# Altium project PA.PrjPcb
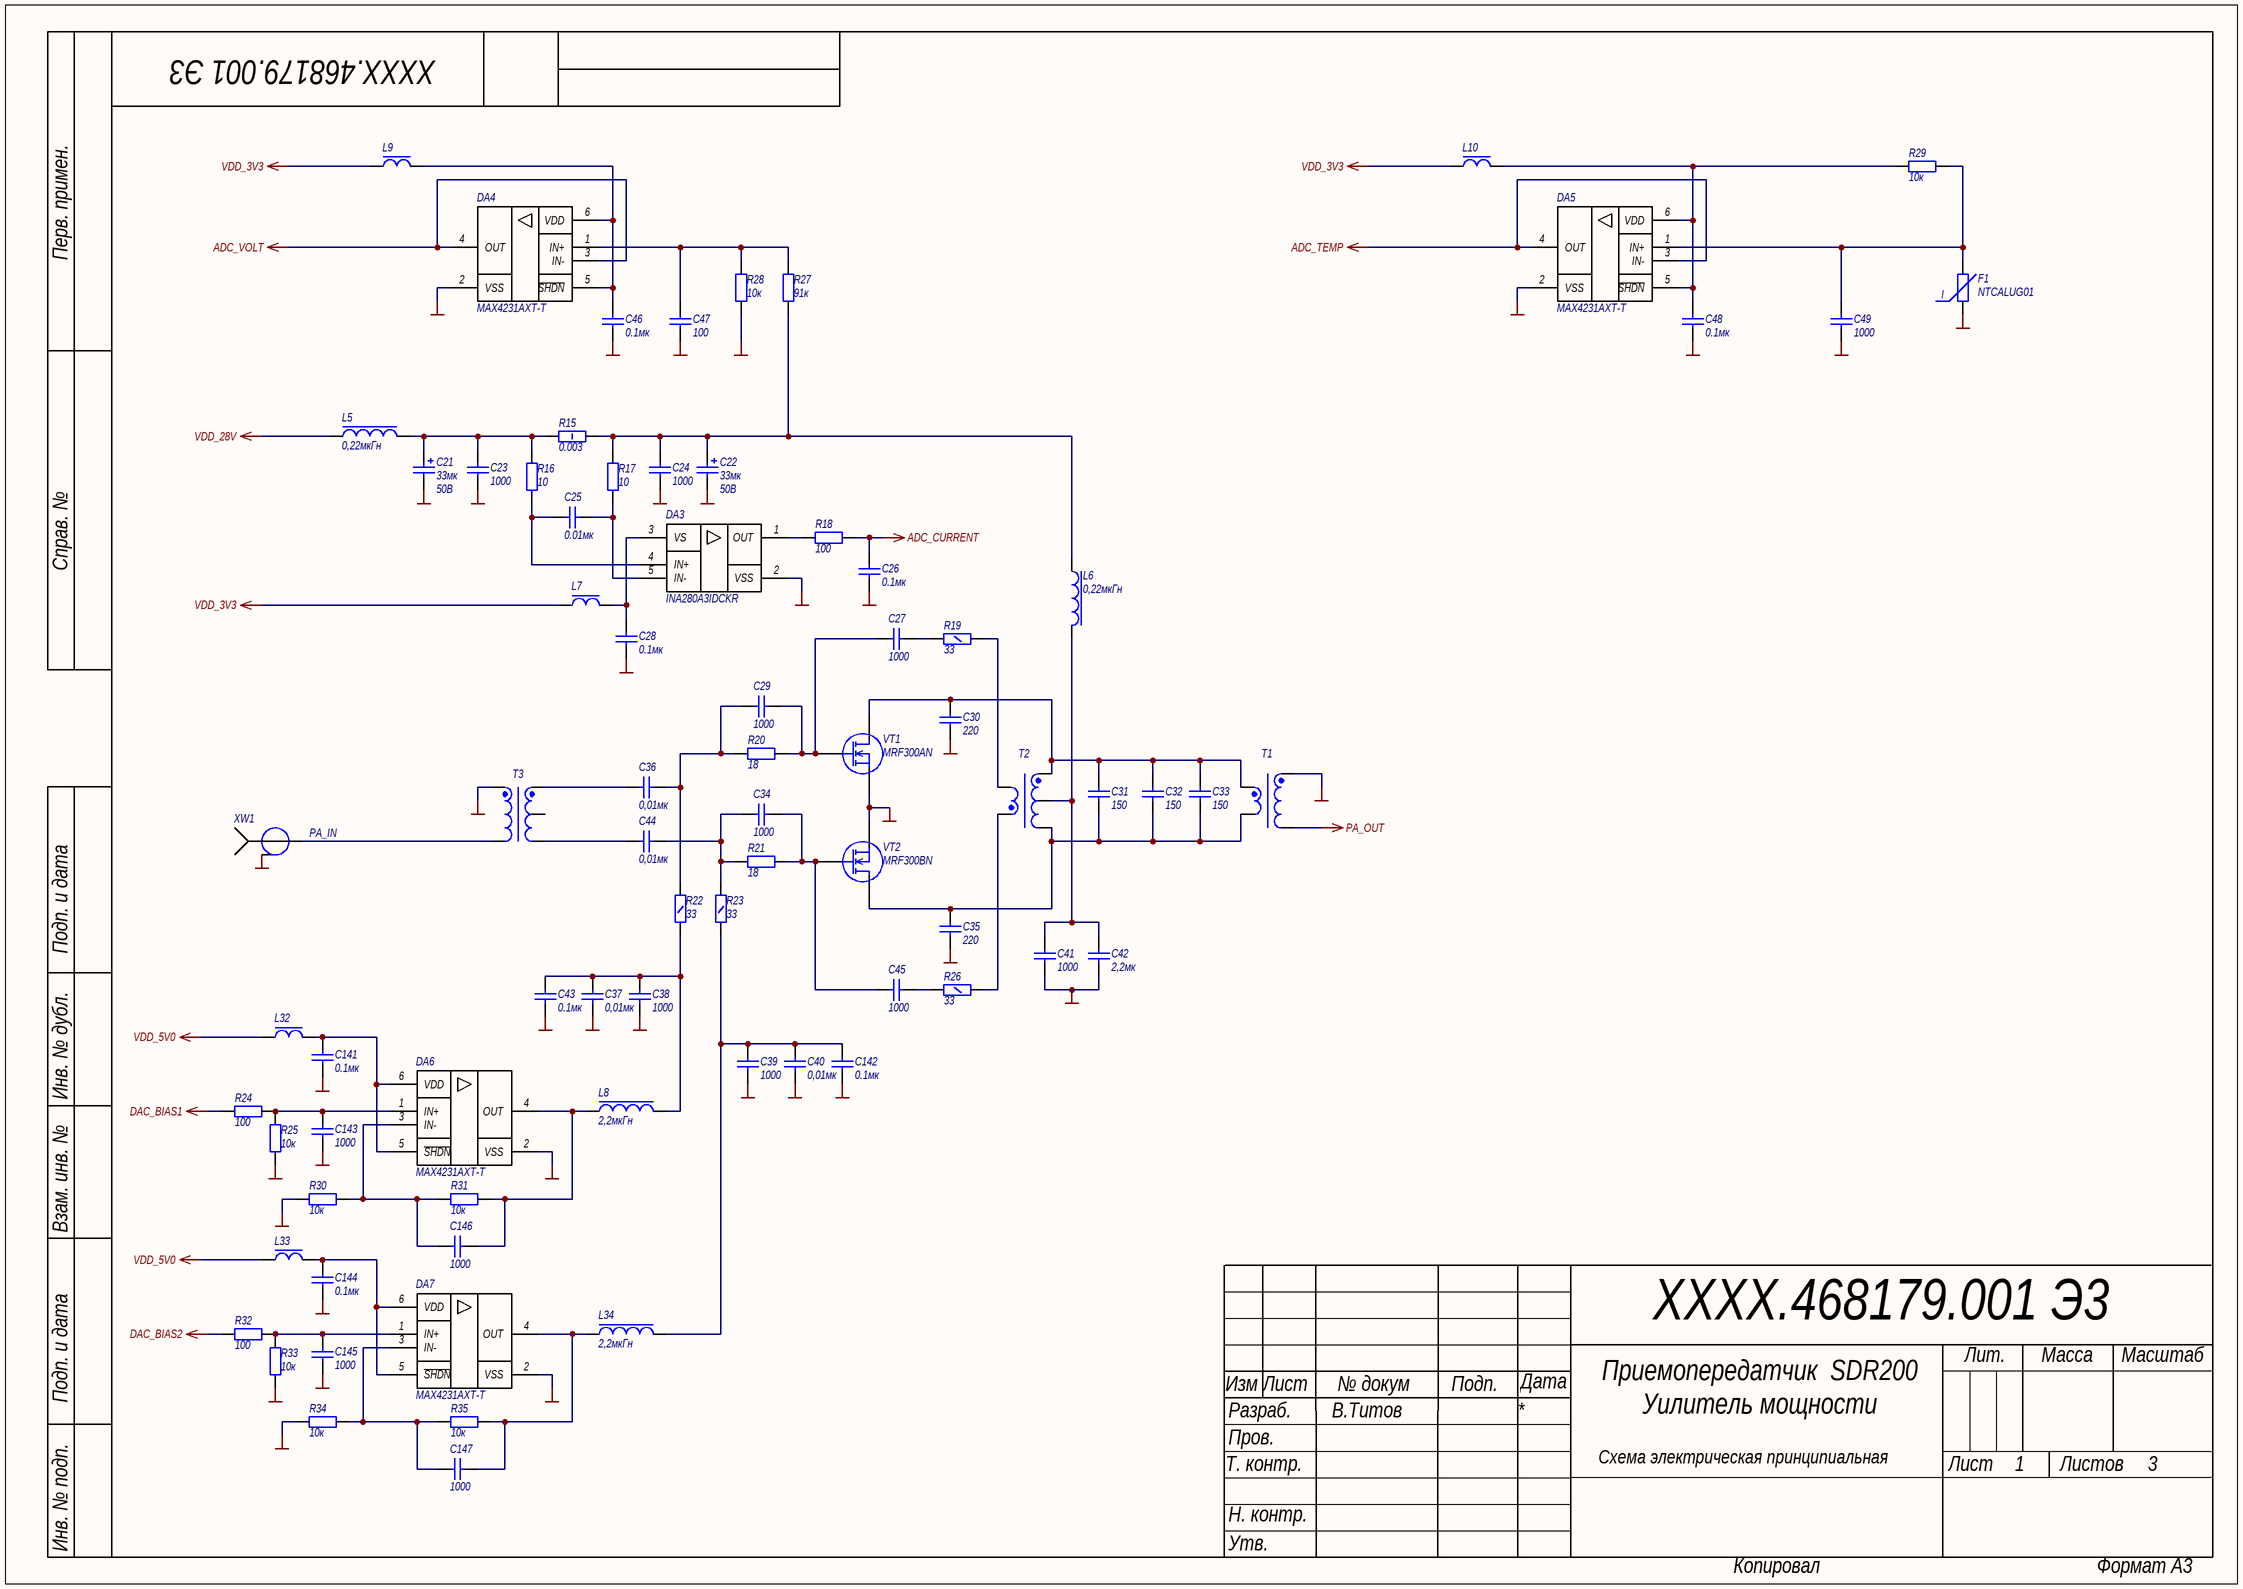
[diagram p0: PA_AMP_v1.SchDoc]
3 sheets, 288 parts. Net scope: global (net labels, ports and power ports of the same name join across sheets).
Board file: PA_v1.PcbDoc
Sheets:
  PA_AMP_v1.SchDoc
  PA_LPF.SchDoc
  PA_MCU.SchDoc

## Sheet PA_AMP_v1.SchDoc: Приемопередатчик  SDR200
size 420 x 297 mm; Author: В.Титов; DrawnBy: В.Титов; DocumentNumber: ХХХХ.468179.001 Э3; SheetNumber: 1; SheetTotal: 3; DocumentType: Схема электрическая принципиальная; Title2: Уилитель мощности; Scale: 1:1

### Parts
C21  Power/Voltage: 50В  [CAPAE7664X77L]  (hidden comment: 33мк)
C22  Power/Voltage: 50В  [CAPAE7664X77L]  (hidden comment: 33мк)
C23  1000  [CAPC2012X12L]
C24  1000  [CAPC2012X12L]
C25  0.01мк  [CAPC1005X06N]
C26  0.1мк  [CAPC1005X06N]
C27  1000  [CAPC3216X19L]
C28  0.1мк  [CAPC1005X06N]
C29  1000  [CAPC2012X12L]
C30  220  [CAPC3216X19L]
C31  150  [CAPC3216X19L]
C32  150  [CAPC3216X19L]
C33  150  [CAPC3216X19L]
C34  1000  [CAPC2012X12L]
C35  220  [CAPC3216X19L]
C36  0,01мк  [CAPC2012X12L]
C37  0,01мк  [CAPC2012X12L]
C38  1000  [CAPC2012X12L]
C39  1000  [CAPC2012X12L]
C40  0,01мк  [CAPC2012X12L]
C41  1000  [CAPC3216X19L]
C42  2,2мк  [CAPC3216X19L]
C43  0.1мк  [CAPC1608X08L]
C44  0,01мк  [CAPC2012X12L]
C45  1000  [CAPC3216X19L]
C46  0.1мк  [CAPC1005X06N]
C47  100  [CAPC1005X06N]
C48  0.1мк  [CAPC1005X06N]
C49  1000  [CAPC1005X06N]
C141  0.1мк  [CAPC1005X06N]
C142  0.1мк  [CAPC1608X08L]
C143  1000  [CAPC1005X06N]
C144  0.1мк  [CAPC1005X06N]
C145  1000  [CAPC1005X06N]
C146  1000  [CAPC1005X06N]
C147  1000  [CAPC1005X06N]
DA3  INA280A3IDCKR  [SOT65P210X110-5L]
DA4  MAX4231AXT-T  [TSOP65P210X100-6L]
DA5  MAX4231AXT-T  [TSOP65P210X100-6L]
DA6  MAX4231AXT-T  [TSOP65P210X100-6L]
DA7  MAX4231AXT-T  [TSOP65P210X100-6L]
F1  NTCALUG01  [NTCALUG01T]
L5  0,22мкГн  [CSAB0530]
L6  0,22мкГн  [CSAB0530]
L7  BLM18PG121SN1D  [INDC1608X08L]  (value not drawn)
L8  2,2мкГн  [CSAB0420]
L9  BLM18PG121SN1D  [INDC1608X08L]  (value not drawn)
L10  BLM18PG121SN1D  [INDC1608X08L]  (value not drawn)
L32  BLM18PG121SN1D  [INDC1608X08L]  (value not drawn)
L33  BLM18PG121SN1D  [INDC1608X08L]  (value not drawn)
L34  2,2мкГн  [CSAB0420]
R15  0.003  [RESC6332X04N]
R16  10  [RESC1005X06N]
R17  10  [RESC1005X06N]
R18  100  [RESC1005X06N]
R19  33  [RESC3216X04L]
R20  18  [RESC2012X05L]
R21  18  [RESC2012X05L]
R22  33  [RESC3216X04L]
R23  33  [RESC3216X04L]
R24  100  [RESC1005X06N]
R25  10к  [RESC1005X06N]
R26  33  [RESC3216X04L]
R27  91к  [RESC1005X06N]
R28  10к  [RESC1005X06N]
R29  10к  [RESC1005X06N]
R30  10к  [RESC1005X06N]
R31  10к  [RESC1005X06N]
R32  100  [RESC1005X06N]
R33  10к  [RESC1005X06N]
R34  10к  [RESC1005X06N]
R35  10к  [RESC1005X06N]
T1  Трансформатор PUM_IN  [TRSF_OUT]  (value not drawn)
T2  Трансформатор PUM_IN  [TRSF_VOLT]  (value not drawn)
T3  Трансформатор PUM_IN  [Transformer_KV_PAIN]  (value not drawn)
VT1  MRF300AN  [TO-247-3]
VT2  MRF300BN  [TO-247-3]
XW1  SMA-JR  [SMA-JR]  (value not drawn)

### Nets
ADC_CURRENT: C26.2 R18.1
ADC_TEMP: DA5.3(IN-) DA5.4(OUT)
ADC_VOLT: DA4.3(IN-) DA4.4(OUT)
DAC_BIAS1: R24.1
DAC_BIAS2: R32.1
GND: C21.2 C22.2 C23.1 C24.1 C26.1 C28.1 C30.1 C35.1 C37.1 C38.1 C39.1 C40.1 C41.1 C42.1 C43.1 C46.2 C47.2 C48.2 C49.2 C141.1 C142.1 C143.1 C144.1 C145.1 DA3.2(VSS) DA4.2(VSS) DA5.2(VSS) DA6.2(VSS) DA7.2(VSS) F1.2 R25.2 R28.1 R30.1 R33.2 R34.1 T1.3 T3.5(PRIMARY_DOT) VT1.2(S) VT2.2(S) XW1.2
PA_OUT: T1.4
VDD_3V3: L7.1 L9.1 L10.1
VDD_5V0: L32.1 L33.1
VDD_28V: L5.1
NetC21_1: C21.1 C23.2 L5.2 R15.1 R16.1
NetC22_1: C22.1 C24.2 L6.1 R15.2 R17.1 R27.2
NetC25_1: C25.1 DA3.5(GND) R17.2
NetC25_2: C25.2 DA3.4(IN+) R16.2
NetC27_1: C27.1 R19.1
NetC27_2: C27.2 C29.1 R20.2 VT1.1(GATE)
NetC28_2: C28.2 DA3.3(VS) L7.2
NetC29_2: C29.2 C36.1 R20.1 R22.1
NetC30_2: C30.2 C31.2 C32.2 C33.2 T1.1 T2.1 VT1.3(D)
NetC31_1: C31.1 C32.1 C33.1 C35.2 T1.2 T2.3 VT2.1(D)
NetC34_1: C34.1 C45.2 R21.2 VT2.3(GATE)
NetC34_2: C34.2 C44.1 R21.1 R23.1
NetC36_2: C36.2 T3.1(SECONDARY_DOT)
NetC37_2: C37.2 C38.2 C43.2 L8.2 R22.2
NetC39_2: C39.2 C40.2 C142.2 L34.2 R23.2
NetC41_2: C41.2 C42.2 L6.2 T2.2
NetC44_2: C44.2 T3.3(SECONDARY)
NetC45_1: C45.1 R26.1
NetC46_1: C46.1 DA4.5(GND) DA4.6(VDD) L9.2
NetC47_1: C47.1 DA4.1(IN+) R27.1 R28.2
NetC48_1: C48.1 DA5.5(GND) DA5.6(VDD) L10.2 R29.1
NetC49_1: C49.1 DA5.1(IN+) F1.1 R29.2
NetC141_2: C141.2 DA6.5(GND) DA6.6(VDD) L32.2
NetC143_2: C143.2 DA6.1(IN+) R24.2 R25.1
NetC144_2: C144.2 DA7.5(GND) DA7.6(VDD) L33.2
NetC145_2: C145.2 DA7.1(IN+) R32.2 R33.1
NetC146_1: C146.1 DA6.4(OUT) L8.1 R31.2
NetC146_2: C146.2 DA6.3(IN-) R30.2 R31.1
NetC147_1: C147.1 DA7.4(OUT) L34.1 R35.2
NetC147_2: C147.2 DA7.3(IN-) R34.2 R35.1
NetDA3_1: DA3.1(OUT) R18.2
NetR19_2: R19.2 T2.4(FB)
NetR26_2: R26.2 T2.5(FB)
NetT3_4: T3.4(PRIMARY) XW1.1

Not connected (* = marked no-connect by the designer): T3 2(SECONARY_CT)

### Notes on the sheet
- (near XW1) PA_IN
- Перв. примен.
- Справ. №
- Подп. и дата
- Инв. № дубл.
- Взам. инв. №
- Изм
- Лист
- № докум
- Подп.
- Дата
- Лит.
- Масса
- Масштаб
- Т. контр.
- Разраб.
- Пров.
- Листов
- Н. контр.
- Инв. № подп.
- Утв.
- Копировал
- Формат А3
- (in symbol Терморезистор NTCALUG01) I

### Library data of the parts
C21 C22 = Конденсатор гибридный SMD 33мкФ ±20% 50В: Гибридный ЧИП-конденсатор; ManufacturerPartNumber: EEHZC1H330XP; Manufacturer: Panasonic; Tolerance: ±20%; Published: 8-Jun-2000; LatestRevisionDate: 29-May-2009; LatestRevisionNote: IPC-7351 Footprint Added.; Publisher: Altium Limited; PackageDescription: ZC Series - Anti-Vibration; PackageReference: ZC Series; Value: 33мк
C23 C24 C29 C34 C38 C39 = Кер.ЧИП конд. 0805 1000пФ X7R 10% 100В: Кер. ЧИП-конденсатор; Manufacturer: WALSIN; ManufacturerPartNumber: 0805B102K100; Power/Voltage: 100В; TKE: X7R; Tolerance: ±10%; Value: 1000
C25 = Кер.ЧИП конд. 0402 0.01мкФ X7R 10%, 50В: Кер. ЧИП-конденсатор; Power/Voltage: 50В; TKE: X7R; Tolerance: ±20%; Value: 0.01мк
C26 C28 C46 C48 C141 C144 = Кер.ЧИП конд. 0402 0.1мкФ X7R 10%, 16В: Кер. ЧИП-конденсатор; Power/Voltage: 16В; TKE: X7R; Tolerance: ±10%; PackageReference: 0402; Value: 0.1мк
C27 C41 C45 = Кер.ЧИП конд. 1206 1000пФ X7К 10% 2000В: Кер. ЧИП-конденсатор; Manufacturer: Johanson; ManufacturerPartNumber: 202R18W102KV4E; Power/Voltage: 2000В; TKE: X7R; Tolerance: ±10%; Value: 1000
C30 C35 = Кер.ЧИП конд. 1206 220пФ NP0 5% 2000В: Кер. ЧИП-конденсатор; Manufacturer: Johanson; ManufacturerPartNumber: 202R18W102KV4E; Power/Voltage: 2000В; TKE: X7R; Tolerance: ±10%; Value: 220
C31-C33 = Кер.ЧИП конд. 1206 150пФ NP0 5% 2000В: Кер. ЧИП-конденсатор; Manufacturer: Johanson; ManufacturerPartNumber: 202R18W102KV4E; Power/Voltage: 2000В; TKE: X7R; Tolerance: ±10%; Value: 150
C36 C37 C40 C44 = Кер.ЧИП конд. 0805 0,01 мкФ X7R 10% 250В: Кер. ЧИП-конденсатор; Manufacturer: Murate; ManufacturerPartNumber: GRM21BR72E103KW03; Power/Voltage: 250В; TKE: X7R; Tolerance: ±10%; Value: 0,01мк
C42 = Кер.ЧИП конд. 1206 2,2мкФ X7R 10% 100В: Кер. ЧИП-конденсатор; Manufacturer: Murata; ManufacturerPartNumber: GRM31CR72A225KA73L; Power/Voltage: 100В; TKE: X7R; Tolerance: ±10%; Value: 2,2мк
C43 C142 = Кер.ЧИП конд. 0603 0.1мкФ X7R 10% 50В: Кер. ЧИП-конденсатор; Manufacturer: Murata; ManufacturerPartNumber: GRM188R71H104KA93D; Power/Voltage: 50В; TKE: X7R; Tolerance: ±10%; Value: 0.1мк
C47 = Кер.ЧИП конд. 0402 100пФ NPO 5%, 50В: Кер. ЧИП-конденсатор; Power/Voltage: 50В; TKE: NPO; Tolerance: ±5%; PackageReference: 0402; Value: 100
C49 C143 C145-C147 = Кер.ЧИП конд. 0402 1000пФ NP0 5%, 50В: Кер. ЧИП-конденсатор; Power/Voltage: 50В; TKE: NPO; Tolerance: ±5%; PackageReference: 0402; Value: 1000
DA3 = Микросхема INA280A3IDCKR: 2.7-V to 120-V, 1.1-MHz, High Precision Current Sense Amplifier in Small / (SC-70) Package; Manufacturer: TI; Value: INA280A3IDCKR; ComponentLink1Description: datasheet; ComponentLink1URL: https://datasheets.maximintegrated.com/en/ds/MAX4230-MAX4234.pdf
DA4-DA7 = Микросхема MAX4231AXT-T: High-Output-Drive, 10MHz, 10V/μs,  Rail-to-Rail I/O Op Amps with Shutdown in SC70; Manufacturer: MAXIM; Value: MAX4231AXT-T; ComponentLink1Description: datasheet; ComponentLink1URL: https://datasheets.maximintegrated.com/en/ds/MAX4230-MAX4234.pdf
F1 = Терморезистор NTCALUG01: ЧИП-резистор; Value: NTCALUG01
L5 L6 = ЧИП индуктивность CDCSAB0530-R22M: 0.22мкГн, 19А, 5.2х5.0х3мм, Катушка индуктивности SMD; Manufacturer: Vishay; ManufacturerPartNumber: CDCSAB0530-R22M; Value: 0,22мкГн
L7 L9 L10 L32 L33 = ЧИП дроссель 0603 BLM18PG121SN1D: SMD EMI Suppression Filter EMIFIL; Manufacturer: Murata; ManufacturerPartNumber: BLM18PG121SN1D; Value: BLM18PG121SN1D
L8 L34 = ЧИП индуктивность CSAB0420-2R2M: Molding Power Choke; Manufacturer: Vishay; ManufacturerPartNumber: IHLP1616ABER1R0M11; Value: 2,2мкГн
R15 = Чип резистор 2512 0.003Ом, 5%: ЧИП-резистор PA2512FKF070R003E; Tolerance: ±5%; Value: 0.003
R16 R17 = Чип резистор 0402 10 Ом, 5%: ЧИП-резистор; Tolerance: ±5%; TKE: 100 ppm/°С; PackageReference: 0402; Value: 10
R18 R24 R32 = Чип резистор 0402 100 Ом, 5%: ЧИП-резистор; Tolerance: ±5%; TKE: 100 ppm/°С; PackageReference: 0402; Value: 100
R19 R22 R23 R26 = Чип резистор 1206 33 Ом, 5%: ЧИП-резистор; Manufacturer: ROHM; Tolerance: ±5%; TKE: 300 ppm/°С; PackageReference: 1206; Value: 33
R20 R21 = Чип резистор 0805 18 Ом, 5%: ЧИП-резистор; Tolerance: ±5%; TKE: 100 ppm/°С; PackageReference: 0805; Value: 18
R25 R28-R31 R33-R35 = Чип резистор 0402 10 кОм, 5%: ЧИП-резистор; Tolerance: ±5%; TKE: 100 ppm/°С; PackageReference: 0402; Value: 10к
R27 = Чип резистор 0402 91 кОм, 5%: ЧИП-резистор; Tolerance: ±5%; TKE: 100 ppm/°С; PackageReference: 0402; Value: 91к
T1 = Трансформатор PA_OUT
T2 = Трансформатор PA_OUT_VOLT
T3 = Transformer_KV_PA: Трансформатор на бинокле BN-43-302 (2843000302)mu850 / Первичная обмотка - 2 витка проводом МГТФ 0,12 / Вторичная обмотка - 2 витка проводом МГТФ 0,12; Manufacturer: НЕЛС; Manufacturer Part Number: Трансформатор PUM_IN АНЕЛ.671143.002; SubType: Трансформатор бинокле; Package: BN-43-302 (2843000302) 13.3x10.3 mm; Type: Трансформатор
VT1 = Транзистор MRF300AN: RF Power LDMOS Transistors; ComponentLink1Description: datasheet; ComponentLink1URL: https://www.nxp.com/docs/en/data-sheet/MRF300AN.pdf; Value: MRF300AN
VT2 = Транзистор MRF300BN: RF Power LDMOS Transistors; ComponentLink1Description: datasheet; ComponentLink1URL: https://www.nxp.com/docs/en/data-sheet/MRF300AN.pdf; Value: MRF300BN
XW1 = Соединитель коаксиальный SMA-JR: SMA-JR Разъем SMA гнездо на плату, прямой угол; Value: SMA-JR; ComponentLink1Description: datasheet; ComponentLink1URL: http://www.brownbear.ru/goods/2243.html

## Sheet PA_LPF.SchDoc: Приемопередатчик  SDR200
size 420 x 297 mm; Author: В.Титов; DrawnBy: В.Титов; DocumentNumber: ХХХХ.468179.001 Э3; SheetNumber: 2; SheetTotal: 3; DocumentType: Схема электрическая принципиальная; Title2: Усилитель мощности; Scale: 1:1
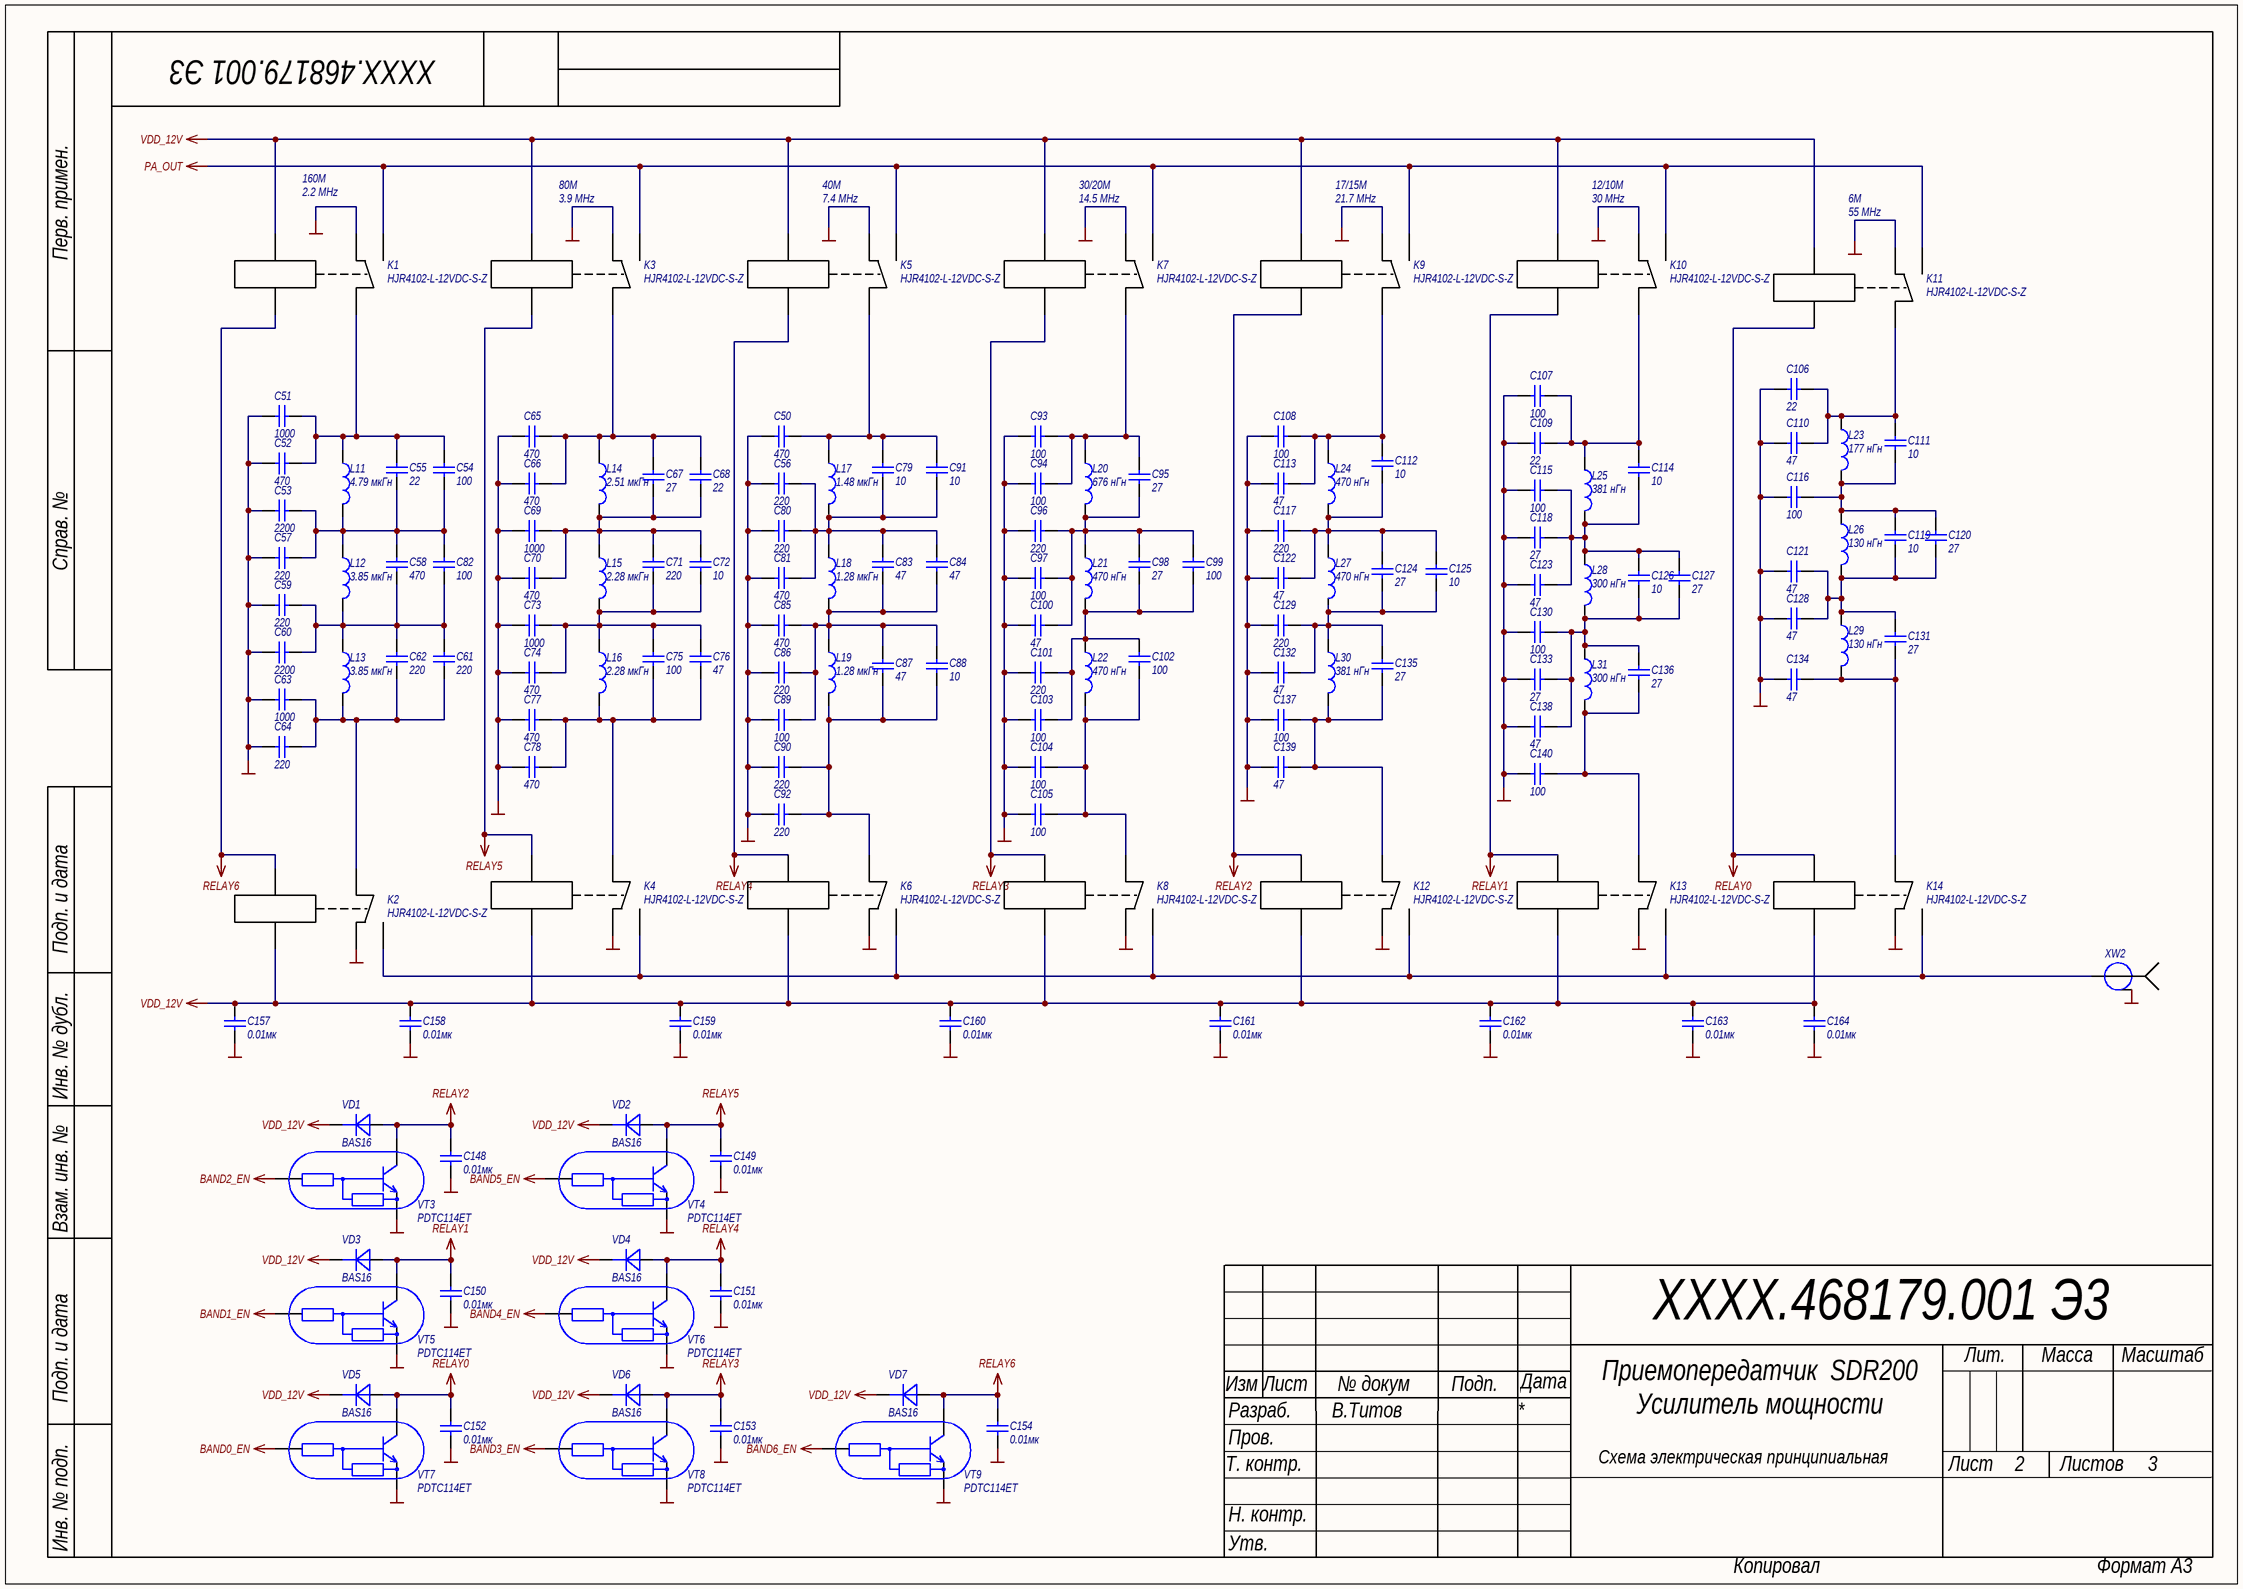
[diagram p1: PA_LPF.SchDoc]

### Parts
C50  470  [CAPC3216X19L]
C51  1000  [CAPC3216X19L]
C52  470  [CAPC3216X19L]
C53  2200  [CAPC3216X19L]
C54  100  [CAPC3216X19L]
C55  22  [CAPC3216X19L]
C56  220  [CAPC3216X19L]
C57  220  [CAPC3216X19L]
C58  470  [CAPC3216X19L]
C59  220  [CAPC3216X19L]
C60  2200  [CAPC3216X19L]
C61  220  [CAPC3216X19L]
C62  220  [CAPC3216X19L]
C63  1000  [CAPC3216X19L]
C64  220  [CAPC3216X19L]
C65  470  [CAPC3216X19L]
C66  470  [CAPC3216X19L]
C67  27  [CAPC3216X19L]
C68  22  [CAPC3216X19L]
C69  1000  [CAPC3216X19L]
C70  470  [CAPC3216X19L]
C71  220  [CAPC3216X19L]
C72  10  [CAPC3216X19L]
C73  1000  [CAPC3216X19L]
C74  470  [CAPC3216X19L]
C75  100  [CAPC3216X19L]
C76  47  [CAPC3216X19L]
C77  470  [CAPC3216X19L]
C78  470  [CAPC3216X19L]
C79  10  [CAPC3216X19L]
C80  220  [CAPC3216X19L]
C81  470  [CAPC3216X19L]
C82  100  [CAPC3216X19L]
C83  47  [CAPC3216X19L]
C84  47  [CAPC3216X19L]
C85  470  [CAPC3216X19L]
C86  220  [CAPC3216X19L]
C87  47  [CAPC3216X19L]
C88  10  [CAPC3216X19L]
C89  100  [CAPC3216X19L]
C90  220  [CAPC3216X19L]
C91  10  [CAPC3216X19L]
C92  220  [CAPC3216X19L]
C93  100  [CAPC3216X19L]
C94  100  [CAPC3216X19L]
C95  27  [CAPC3216X19L]
C96  220  [CAPC3216X19L]
C97  100  [CAPC3216X19L]
C98  27  [CAPC3216X19L]
C99  100  [CAPC3216X19L]
C100  47  [CAPC3216X19L]
C101  220  [CAPC3216X19L]
C102  100  [CAPC3216X19L]
C103  100  [CAPC3216X19L]
C104  100  [CAPC3216X19L]
C105  100  [CAPC3216X19L]
C106  22  [CAPC3216X19L]
C107  100  [CAPC3216X19L]
C108  100  [CAPC3216X19L]
C109  22  [CAPC3216X19L]
C110  47  [CAPC3216X19L]
C111  10  [CAPC3216X19L]
C112  10  [CAPC3216X19L]
C113  47  [CAPC3216X19L]
C114  10  [CAPC3216X19L]
C115  100  [CAPC3216X19L]
C116  100  [CAPC3216X19L]
C117  220  [CAPC3216X19L]
C118  27  [CAPC3216X19L]
C119  10  [CAPC3216X19L]
C120  27  [CAPC3216X19L]
C121  47  [CAPC3216X19L]
C122  47  [CAPC3216X19L]
C123  47  [CAPC3216X19L]
C124  27  [CAPC3216X19L]
C125  10  [CAPC3216X19L]
C126  10  [CAPC3216X19L]
C127  27  [CAPC3216X19L]
C128  47  [CAPC3216X19L]
C129  220  [CAPC3216X19L]
C130  100  [CAPC3216X19L]
C131  27  [CAPC3216X19L]
C132  47  [CAPC3216X19L]
C133  27  [CAPC3216X19L]
C134  47  [CAPC3216X19L]
C135  27  [CAPC3216X19L]
C136  27  [CAPC3216X19L]
C137  100  [CAPC3216X19L]
C138  47  [CAPC3216X19L]
C139  47  [CAPC3216X19L]
C140  100  [CAPC3216X19L]
C148  0.01мк  [CAPC1005X06N]
C149  0.01мк  [CAPC1005X06N]
C150  0.01мк  [CAPC1005X06N]
C151  0.01мк  [CAPC1005X06N]
C152  0.01мк  [CAPC1005X06N]
C153  0.01мк  [CAPC1005X06N]
C154  0.01мк  [CAPC1005X06N]
C157  0.01мк  [CAPC1005X06N]
C158  0.01мк  [CAPC1005X06N]
C159  0.01мк  [CAPC1005X06N]
C160  0.01мк  [CAPC1005X06N]
C161  0.01мк  [CAPC1005X06N]
C162  0.01мк  [CAPC1005X06N]
C163  0.01мк  [CAPC1005X06N]
C164  0.01мк  [CAPC1005X06N]
K1  HJR4102-L-12VDC-S-Z  [HJR4102]
K2  HJR4102-L-12VDC-S-Z  [HJR4102]
K3  HJR4102-L-12VDC-S-Z  [HJR4102]
K4  HJR4102-L-12VDC-S-Z  [HJR4102]
K5  HJR4102-L-12VDC-S-Z  [HJR4102]
K6  HJR4102-L-12VDC-S-Z  [HJR4102]
K7  HJR4102-L-12VDC-S-Z  [HJR4102]
K8  HJR4102-L-12VDC-S-Z  [HJR4102]
K9  HJR4102-L-12VDC-S-Z  [HJR4102]
K10  HJR4102-L-12VDC-S-Z  [HJR4102]
K11  HJR4102-L-12VDC-S-Z  [HJR4102]
K12  HJR4102-L-12VDC-S-Z  [HJR4102]
K13  HJR4102-L-12VDC-S-Z  [HJR4102]
K14  HJR4102-L-12VDC-S-Z  [HJR4102]
L11  4.79 мкГн  [T68-2]
L12  3.85 мкГн  [T68-2]
L13  3.85 мкГн  [T68-2]
L14  2.51 мкГн  [T68-2]
L15  2.28 мкГн  [T68-2]
L16  2.28 мкГн  [T68-2]
L17  1.48 мкГн  [T68-2]
L18  1.28 мкГн  [T68-2]
L19  1.28 мкГн  [T68-2]
L20  676 нГн  [T68-6]
L21  470 нГн  [T68-6]
L22  470 нГн  [T68-6]
L23  177 нГн  [COIL D11 W4 L6]
L24  470 нГн  [T68-6]
L25  381 нГн  [T68-6]
L26  130 нГн  [COIL D11 W4 L10]
L27  470 нГн  [T68-6]
L28  300 нГн  [T68-6]
L29  130 нГн  [COIL D11 W4 L10]
L30  381 нГн  [T68-6]
L31  300 нГн  [T68-6]
VD1  BAS16  [SOT23_N]
VD2  BAS16  [SOT23_N]
VD3  BAS16  [SOT23_N]
VD4  BAS16  [SOT23_N]
VD5  BAS16  [SOT23_N]
VD6  BAS16  [SOT23_N]
VD7  BAS16  [SOT23_N]
VT3  PDTC114ET  [SOT23_N]
VT4  PDTC114ET  [SOT23_N]
VT5  PDTC114ET  [SOT23_N]
VT6  PDTC114ET  [SOT23_N]
VT7  PDTC114ET  [SOT23_N]
VT8  PDTC114ET  [SOT23_N]
VT9  PDTC114ET  [SOT23_N]
XW2  SMA-JR  [SMA-JR]  (value not drawn)

### Nets
BAND0_EN: VT7.1(B)
BAND1_EN: VT5.1(B)
BAND2_EN: VT3.1(B)
BAND3_EN: VT8.1(B)
BAND4_EN: VT6.1(B)
BAND5_EN: VT4.1(B)
BAND6_EN: VT9.1(B)
GND: C50.2 C51.2 C52.2 C53.2 C56.2 C57.2 C59.2 C60.2 C63.2 C64.2 C65.2 C66.2 C69.2 C70.2 C73.2 C74.2 C77.2 C78.2 C80.2 C81.2 C85.2 C86.2 C89.2 C90.2 C92.2 C93.2 C94.2 C96.2 C97.2 C100.2 C101.2 C103.2 C104.2 C105.2 C106.2 C107.2 C108.2 C109.2 C110.2 C113.2 C115.2 C116.2 C117.2 C118.2 C121.2 C122.2 C123.2 C128.2 C129.2 C130.2 C132.2 C133.2 C134.2 C137.2 C138.2 C139.2 C140.2 C148.1 C149.1 C150.1 C151.1 C152.1 C153.1 C154.1 C157.1 C158.1 C159.1 C160.1 C161.1 C162.1 C163.1 C164.1 K1.7 K2.7 K3.7 K4.7 K5.7 K6.7 K7.7 K8.7 K9.7 K10.7 K11.7 K12.7 K13.7 K14.7 VT3.2(E) VT4.2(E) VT5.2(E) VT6.2(E) VT7.2(E) VT8.2(E) VT9.2(E) XW2.2
PA_OUT: K1.6 K3.6 K5.6 K7.6 K9.6 K10.6 K11.6
RELAY0: C152.2 K11.5 K14.5 VD5.1(A) VT7.3(C)
RELAY1: C150.2 K10.5 K13.5 VD3.1(A) VT5.3(C)
RELAY2: C148.2 K9.5 K12.5 VD1.1(A) VT3.3(C)
RELAY3: C153.2 K7.5 K8.5 VD6.1(A) VT8.3(C)
RELAY4: C151.2 K5.5 K6.5 VD4.1(A) VT6.3(C)
RELAY5: C149.2 K3.5 K4.5 VD2.1(A) VT4.3(C)
RELAY6: C154.2 K1.5 K2.5 VD7.1(A) VT9.3(C)
VDD_12V: C157.2 C158.2 C159.2 C160.2 C161.2 C162.2 C163.2 C164.2 K1.8 K2.8 K3.8 K4.8 K5.8 K6.8 K7.8 K8.8 K9.8 K10.8 K11.8 K12.8 K13.8 K14.8 VD1.3(K) VD2.3(K) VD3.3(K) VD4.3(K) VD5.3(K) VD6.3(K) VD7.3(K)
NetC50_1: C50.1 C79.2 C91.2 K5.12 L17.1
NetC51_1: C51.1 C52.1 C54.2 C55.2 K1.12 L11.1
NetC53_1: C53.1 C54.1 C55.1 C57.1 C58.2 C82.2 L11.2 L12.1
NetC56_1: C56.1 C79.1 C80.1 C81.1 C83.2 C84.2 C91.1 L17.2 L18.1
NetC58_1: C58.1 C59.1 C60.1 C61.2 C62.2 C82.1 L12.2 L13.1
NetC61_1: C61.1 C62.1 C63.1 C64.1 K2.12 L13.2
NetC65_1: C65.1 C66.1 C67.2 C68.2 K3.12 L14.1
NetC67_1: C67.1 C68.1 C69.1 C70.1 C71.1 C72.2 L14.2 L15.1
NetC71_2: C71.2 C72.1 C73.1 C74.1 C75.2 C76.2 L15.2 L16.1
NetC75_1: C75.1 C76.1 C77.1 C78.1 K4.12 L16.2
NetC83_1: C83.1 C84.1 C85.1 C86.1 C87.2 C88.2 C89.1 L18.2 L19.1
NetC87_1: C87.1 C88.1 C90.1 C92.1 K6.12 L19.2
NetC93_1: C93.1 C94.1 C95.2 K7.12 L20.1
NetC95_1: C95.1 C96.1 C97.1 C98.2 C99.2 C100.1 L20.2 L21.1
NetC98_1: C98.1 C99.1 C101.1 C102.2 C103.1 L21.2 L22.1
NetC102_1: C102.1 C104.1 C105.1 K8.12 L22.2
NetC106_1: C106.1 C110.1 C111.2 K11.12 L23.1
NetC107_1: C107.1 C109.1 C114.2 K10.12 L25.1
NetC108_1: C108.1 C112.2 C113.1 K9.12 L24.1
NetC111_1: C111.1 C116.1 C119.2 C120.2 L23.2 L26.1
NetC112_1: C112.1 C117.1 C122.1 C124.2 C125.2 L24.2 L27.1
NetC114_1: C114.1 C115.1 C118.1 C123.1 C126.2 C127.2 L25.2 L28.1
NetC119_1: C119.1 C120.1 C121.1 C128.1 C131.2 L26.2 L29.1
NetC124_1: C124.1 C125.1 C129.1 C132.1 C135.2 L27.2 L30.1
NetC126_1: C126.1 C127.1 C130.1 C133.1 C136.2 C138.1 L28.2 L31.1
NetC131_1: C131.1 C134.1 K14.12 L29.2
NetC135_1: C135.1 C137.1 C139.1 K12.12 L30.2
NetC136_1: C136.1 C140.1 K13.12 L31.2
NetK2_6: K2.6 K4.6 K6.6 K8.6 K12.6 K13.6 K14.6 XW2.1

### Notes on the sheet
- 160M
- 80M
- 40M
- 30/20M
- 17/15M
- 12/10M
- 2.2 MHz
- 3.9 MHz
- 7.4 MHz
- 14.5 MHz
- 21.7 MHz
- 30 MHz
- 55 MHz
- 6M
- Перв. примен.
- Справ. №
- Подп. и дата
- Инв. № дубл.
- Взам. инв. №
- Изм
- Лист
- № докум
- Подп.
- Дата
- Лит.
- Масса
- Масштаб
- Т. контр.
- Разраб.
- Пров.
- Листов
- Н. контр.
- Инв. № подп.
- Утв.
- Копировал
- Формат А3

### Library data of the parts
C50 C52 C58 C65 C66 C70 C74 C77 C78 C81 C85 = Кер.ЧИП конд. 1206 470пФ NP0 10% 2000В: Кер. ЧИП-конденсатор; Manufacturer: WALSIN; ManufacturerPartNumber: 1206B471K202; Power/Voltage: 2000В; TKE: NP0; Tolerance: ±10%; Value: 470
C51 C63 C69 C73 = Кер.ЧИП конд. 1206 1000пФ X7К 10% 2000В: as C27 on sheet PA_AMP_v1; Value: 1000
C53 C60 = Кер.ЧИП конд. 1206 2200пФ X7К 10% 1000В: Кер. ЧИП-конденсатор; Manufacturer: WALSIN; ManufacturerPartNumber: 1206B222K102; Power/Voltage: 1000В; TKE: X7R; Tolerance: ±10%; Value: 2200
C54 C75 C82 C89 C93 C94 C97 C99 C102-C105 C107 C108 C115 C116 C130 C137 C140 = Кер.ЧИП конд. 1206 100пФ NP0 5% 2000В: Кер. ЧИП-конденсатор; Manufacturer: WALSIN; ManufacturerPartNumber: 1206N101J202; Power/Voltage: 2000В; TKE: NP0; Tolerance: ±5%; Value: 100
C55 C68 C106 C109 = Кер.ЧИП конд. 1206 22пФ NP0 5% 2000В: Кер. ЧИП-конденсатор; Manufacturer: WALSIN; ManufacturerPartNumber: 1206N220J202; Power/Voltage: 2000В; TKE: NP0; Tolerance: ±5%; Value: 22
C56 C57 C59 C61 C62 C64 C71 C80 C86 C90 C92 C96 C101 C117 C129 = Кер.ЧИП конд. 1206 220пФ NP0 5% 2000В: as C30 on sheet PA_AMP_v1; Value: 220
C67 C95 C98 C118 C120 C124 C127 C131 C133 C135 C136 = Кер.ЧИП конд. 1206 27пФ NP0 10% 2000В: Кер. ЧИП-конденсатор; Manufacturer: WALSIN; ManufacturerPartNumber: 1206N270J202; Power/Voltage: 2000В; TKE: NP0; Tolerance: ±10%; Value: 27
C72 C79 C88 C91 C111 C112 C114 C119 C125 C126 = Кер.ЧИП конд. 1206 10пФ NP0 5% 2000В: Кер. ЧИП-конденсатор; Manufacturer: WALSIN; ManufacturerPartNumber: 1206N100J202; Power/Voltage: 2000В; TKE: NP0; Tolerance: ±5%; Value: 10
C76 C83 C84 C87 C100 C110 C113 C121-C123 C128 C132 C134 C138 C139 = Кер.ЧИП конд. 1206 47пФ NP0 5% 2000В: Кер. ЧИП-конденсатор; Manufacturer: WALSIN; ManufacturerPartNumber: 1206N470J202; Power/Voltage: 2000В; TKE: NP0; Tolerance: ±5%; Value: 47
C148-C154 C157-C164 = Кер.ЧИП конд. 0402 0.01мкФ X7R 10%, 50В: as C25 on sheet PA_AMP_v1; Value: 0.01мк
K1-K14 = Реле HJR4102-L-12VDC-S-Z: Реле 1пер. 12VDC, 1A/240VAC; Value: HJR4102-L-12VDC-S-Z; ComponentLink1Description: datasheet; ComponentLink1URL: https://www.ti.com/lit/ds/symlink/tlvh431a.pdf?ts=1606914625003&ref_url=https%253A%252F%252Fwww.google.com%252F
L11 = Индуктивность T68-2 4.79 мкГн: 29 витков; Value: 4.79 мкГн
L12 L13 = Индуктивность T68-2 3.85 мкГн: 26 витков; Value: 3.85 мкГн
L14 = Индуктивность T68-2 2.51 мкГн: 21 виток; Value: 2.51 мкГн
L15 L16 = Индуктивность T68-2 2.28 мкГн: Value: 2.28 мкГн
L17 = Индуктивность T68-2 1.48 мкГн: 16 витков; Value: 1.48 мкГн
L18 L19 = Индуктивность T68-2 1.28 мкГн: 16 витков; Value: 1.28 мкГн
L20 = Индуктивность T68-6 676 нГн: 12 витков; Value: 676 нГн
L21 L22 L24 L27 = Индуктивность T68-6 470 нГн: 10 витков; Value: 470 нГн
L23 = Индуктивность 177 нГн: 4 витка, диаметр 11мм, длина 6мм; Value: 177 нГн
L25 L30 = Индуктивность T68-6 381 нГн: 9 витков; Value: 381 нГн
L26 L29 = Индуктивность 130 нГн: 4 витка, диаметр 11мм, длина 10мм; Value: 130 нГн
L28 L31 = Индуктивность T68-6 300 нГн: 8 витков; Value: 300 нГн
VD1-VD7 = ЧИП диод BAS16: High-speed switching diodes; Manufacturer: Nexperia; Power/Voltage: 100В; ManufacturerPartNumber: BAS16; Value: BAS16; ComponentLink1Description: datasheet; ComponentLink1URL: https://assets.nexperia.com/documents/data-sheet/BAS16_SER.pdf
VT3-VT9 = ЧИП транзистор PDTC114ET: NPN resistor-equipped transistors;  R1 = 10 k, R2 = 10; ComponentLink1Description: datasheet; ComponentLink1URL: https://assets.nexperia.com/documents/data-sheet/PDTC114E_SER.pdf; Value: PDTC114ET
XW2 = Соединитель коаксиальный SMA-JR: as XW1 on sheet PA_AMP_v1; Value: SMA-JR; ComponentLink1Description: datasheet; ComponentLink1URL: http://www.brownbear.ru/goods/2243.html

## Sheet PA_MCU.SchDoc: Приемопередатчик  SDR200
size 420 x 297 mm; Author: В.Титов; DrawnBy: В.Титов; DocumentNumber: ХХХХ.468179.001 Э3; SheetNumber: 3; SheetTotal: 3; DocumentType: Схема электрическая принципиальная; Title2: Усилитель мощности; Scale: 1:1
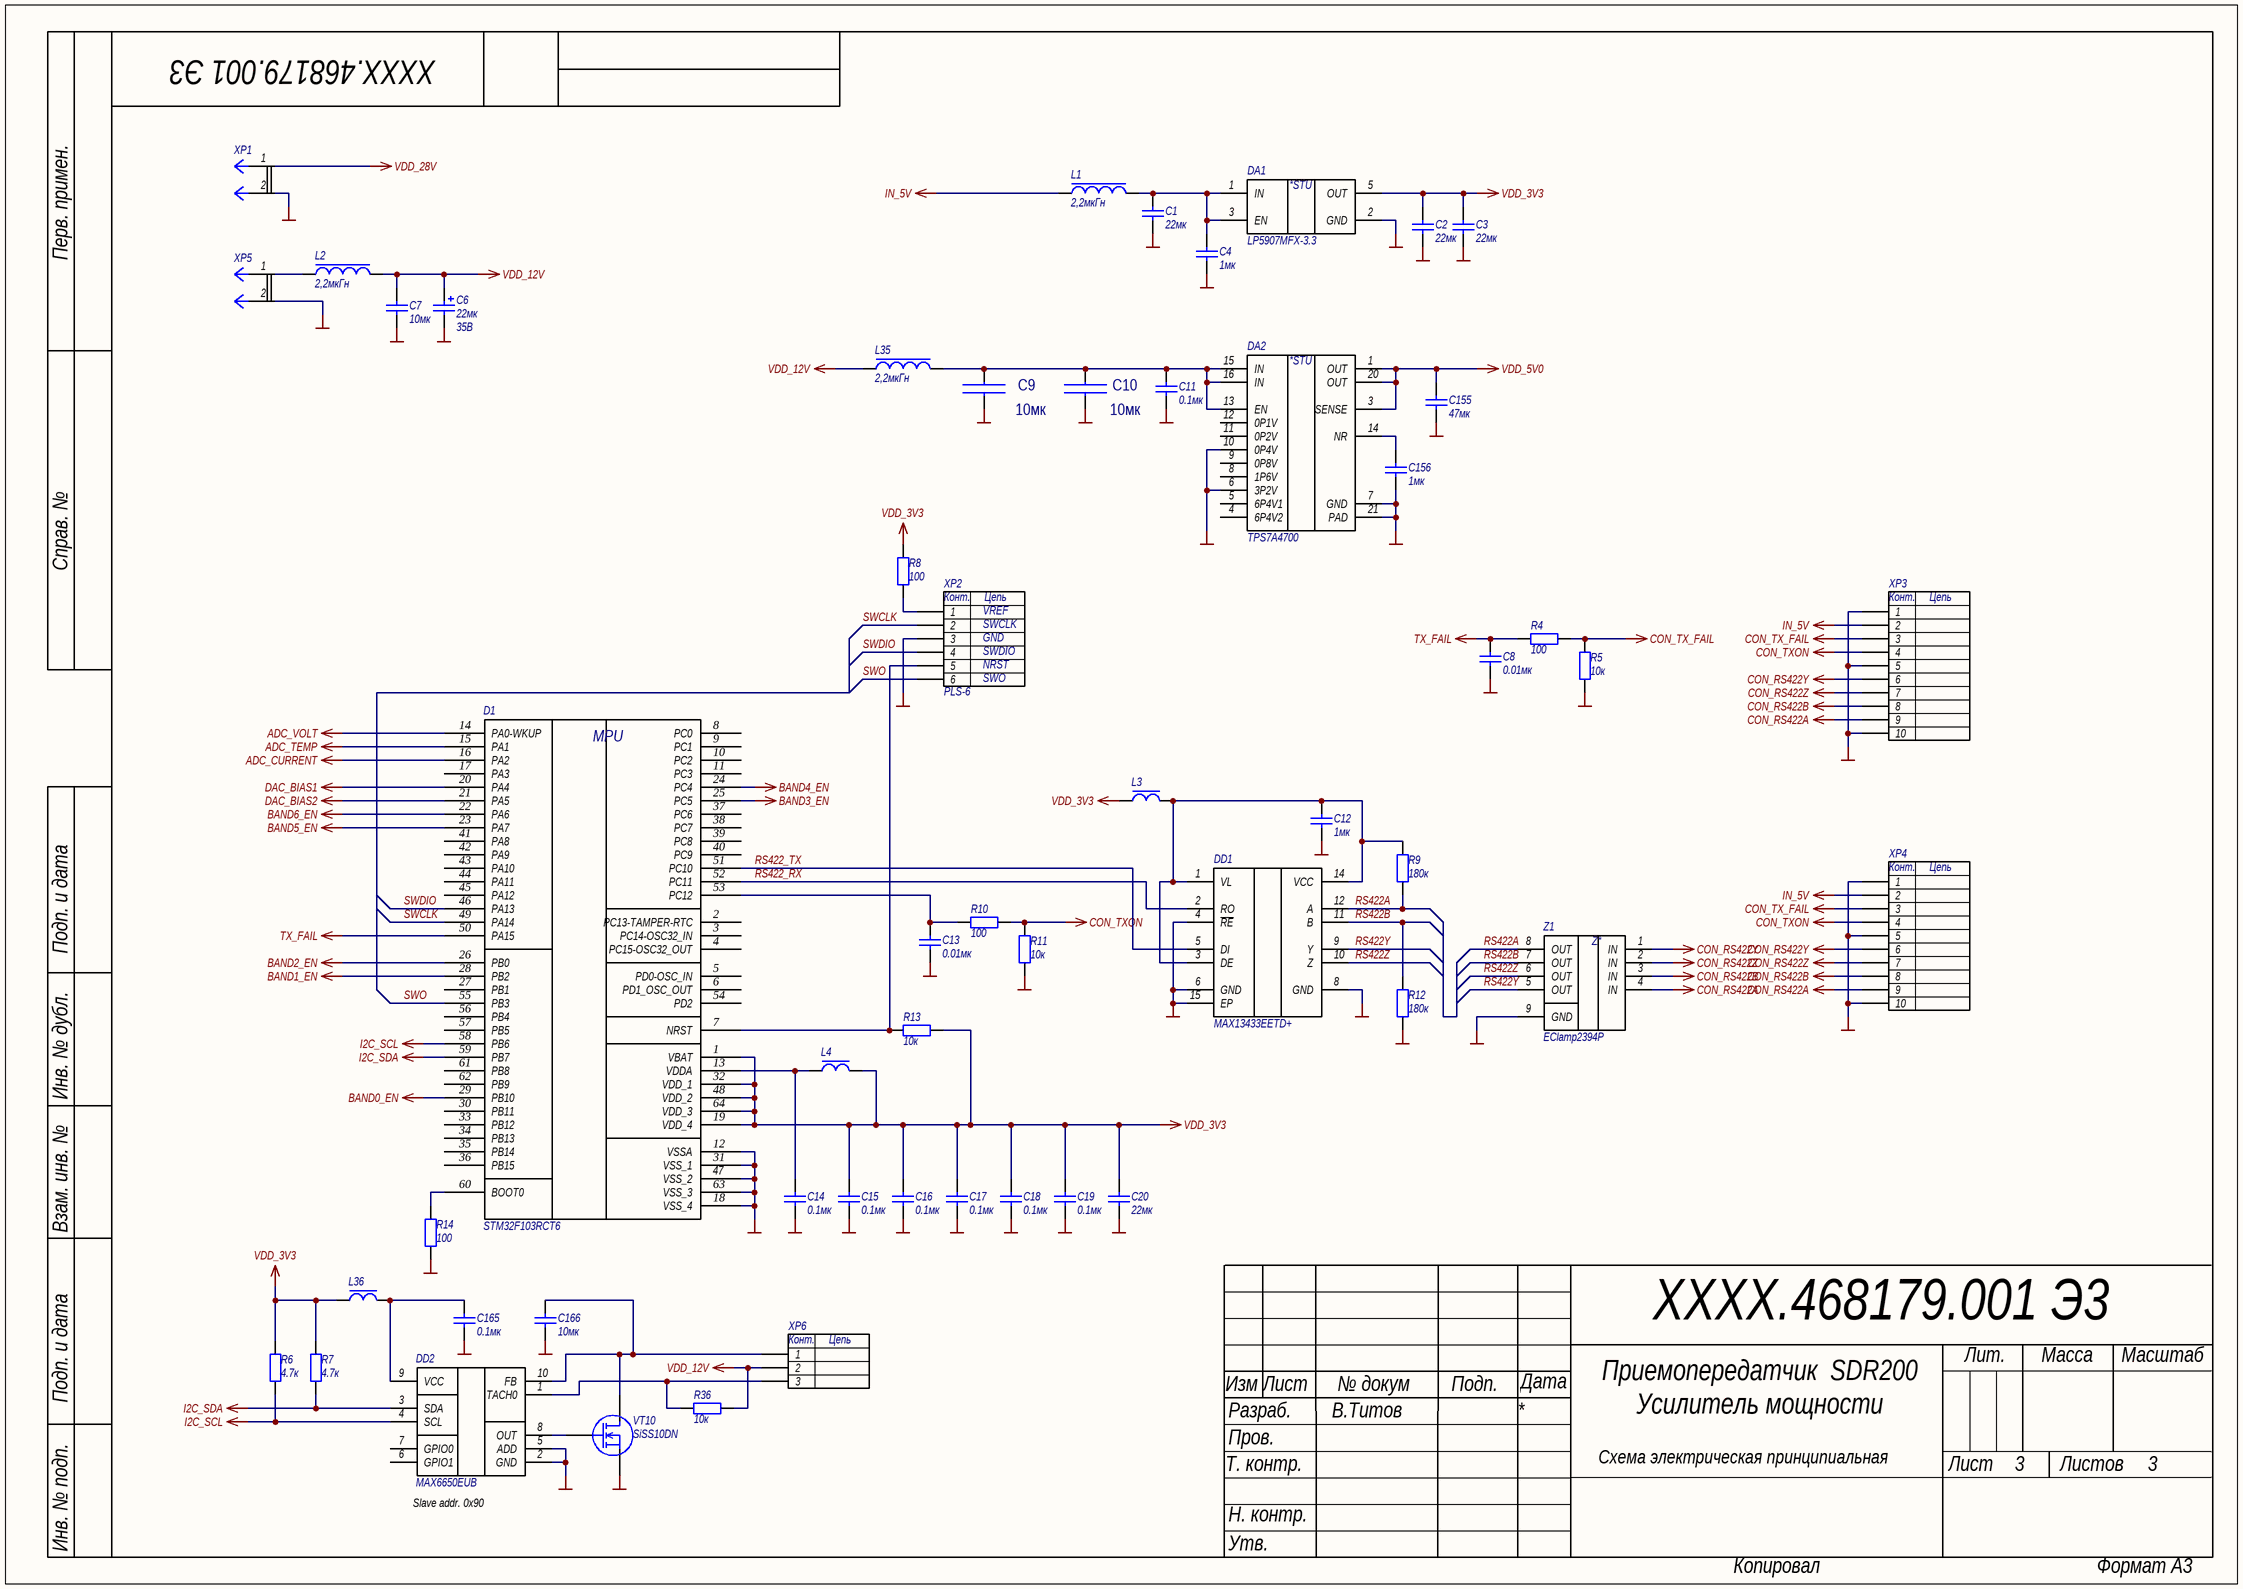
[diagram p2: PA_MCU.SchDoc]

### Parts
C1  22мк  [CAPC2012X12L]
C2  22мк  [CAPC2012X12L]
C3  22мк  [CAPC2012X12L]
C4  1мк  [CAPC1005X06N]
C6  Power/Voltage: 35В  [CAPMP7343X28L]  (hidden comment: 22мк)
C7  10мк  [CAPC3225X27L]
C8  0.01мк  [CAPC1005X06N]
C9  Nominal: 10мк  [CAPC3216X12L]  (hidden comment: CC1206KKX7R8BB106)
C10  Nominal: 10мк  [CAPC2012X09L]  (hidden comment: CC0805KKX5R8BB106)
C11  0.1мк  [CAPC1005X06N]
C12  1мк  [CAPC1005X06N]
C13  0.01мк  [CAPC1005X06N]
C14  0.1мк  [CAPC1005X06N]
C15  0.1мк  [CAPC1005X06N]
C16  0.1мк  [CAPC1005X06N]
C17  0.1мк  [CAPC1005X06N]
C18  0.1мк  [CAPC1005X06N]
C19  0.1мк  [CAPC1005X06N]
C20  22мк  [CAPC2012X12L]
C155  47мк  [CAPC2012X12L]
C156  1мк  [CAPC1005X06N]
C165  0.1мк  [CAPC1005X06N]
C166  10мк  [CAPC3225X27L]
D1  STM32F103RCT6  [QFP50P1200X1200X160-64N]
DA1  LP5907MFX-3.3  [SOT23-5AM]
DA2  TPS7A4700  [QFN65P500X500X100_HS-21L]
DD1  MAX13433EETD+  [SON40P300X80_HS-15L]
DD2  MAX6650EUB  [SOP64P600X175-16N]
L1  2,2мкГн  [CSAB0420]
L2  2,2мкГн  [CSAB0420]
L3  BLM18PG121SN1D  [INDC1608X08L]  (value not drawn)
L4  BLM18PG121SN1D  [INDC1608X08L]  (value not drawn)
L35  2,2мкГн  [CSAB0420]
L36  BLM18PG121SN1D  [INDC1608X08L]  (value not drawn)
R4  100  [RESC1005X06N]
R5  10к  [RESC1005X06N]
R6  4.7к  [RESC1005X06N]
R7  4.7к  [RESC1005X06N]
R8  100  [RESC1005X06N]
R9  180к  [RESC1005X06N]
R10  100  [RESC1005X06N]
R11  10к  [RESC1005X06N]
R12  180к  [RESC1005X06N]
R13  10к  [RESC1005X06N]
R14  100  [RESC1005X06N]
R36  10к  [RESC1005X06N]
VT10  SiSS10DN  [PowerPAK_1212-8W]
XP1  XT60-F  [XT60-F]  (value not drawn)
XP2  PLS-6  [HDR1X6]
XP3  FH12-10S-0.5SVA  [FH12-10S-0.5SH]  (value not drawn)
XP4  FH12-10S-0.5SVA  [FH12-10S-0.5SH]  (value not drawn)
XP5  XT30UPB-M  [XT30UPB-M]  (value not drawn)
XP6  22232031  [22232031]  (value not drawn)
Z1  EClamp2394P  [SON50P160X65_HS-9N]

### Nets
ADC_CURRENT: D1.16(PA2)
ADC_TEMP: D1.15(PA1)
ADC_VOLT: D1.14(PA0-WKUP)
BAND0_EN: D1.29(PB10)
BAND1_EN: D1.28(PB2)
BAND2_EN: D1.26(PB0)
BAND3_EN: D1.25(PC5)
BAND4_EN: D1.24(PC4)
BAND5_EN: D1.23(PA7)
BAND6_EN: D1.22(PA6)
CON_RS422A: XP3.9 XP4.9 Z1.4(IN)
CON_RS422B: XP3.8 XP4.8 Z1.3(IN)
CON_RS422Y: XP3.6 XP4.6 Z1.1(IN)
CON_RS422Z: XP3.7 XP4.7 Z1.2(IN)
CON_TX_FAIL: R4.1 R5.1 XP3.3 XP4.3
CON_TXON: R10.1 R11.1 XP3.4 XP4.4
DAC_BIAS1: D1.20(PA4)
DAC_BIAS2: D1.21(PA5)
GND: C1.1 C2.1 C3.1 C4.1 C6.1 C7.1 C8.1 C11.1 C12.1 C13.1 C14.1 C15.1 C16.1 C17.1 C18.1 C19.1 C20.1 C155.1 C156.1 C165.1 C166.1 D1.12(VSSA) D1.18(VSS_4) D1.31(VSS_1) D1.47(VSS_2) D1.63(VSS_3) DA1.2(GND) DA2.6(3P2V) DA2.7(GND) DA2.10(0P4V) DA2.21(PAD) DD1.4(~{RE}) DD1.6(GND) DD1.8(GND) DD1.15(EP) DD2.2(GND) DD2.5(ADD) R5.2 R11.2 R12.1 R14.2 VT10.S XP1.2 XP2.3 XP3.1 XP3.5 XP3.10 XP4.1 XP4.5 XP4.10 XP5.2 Z1.9(GND)
I2C_SCL: D1.58(PB6) DD2.4(SCL) R6.1
I2C_SDA: D1.59(PB7) DD2.3(SDA) R7.1
IN_5V: L1.1 XP3.2 XP4.2
TX_FAIL: C8.2 D1.50(PA15) R4.2
VDD_3V3: C2.2 C3.2 C15.2 C16.2 C17.2 C18.2 C19.2 C20.2 D1.1(VBAT) D1.19(VDD_4) D1.32(VDD_1) D1.48(VDD_2) D1.64(VDD_3) DA1.5(OUT) L3.1 L4.2 L36.1 R6.2 R7.2 R8.1 R13.2
VDD_5V0: C155.2 DA2.1(OUT) DA2.3(SENSE) DA2.20(OUT)
VDD_12V: C6.2 C7.2 L2.2 L35.1 R36.2 XP6.2
VDD_28V: XP1.1
RS422_RX: D1.52(PC11) DD1.2(RO)
RS422_TX: D1.51(PC10) DD1.5(DI)
RS422A: DD1.12(A) R9.1 Z1.8(OUT)
RS422B: DD1.11(B) R12.2 Z1.7(OUT)
RS422Y: DD1.9(Y) Z1.5(OUT)
RS422Z: DD1.10(Z) Z1.6(OUT)
SWCLK: D1.49(PA14) XP2.2
SWDIO: D1.46(PA13) XP2.4
SWO: D1.55(PB3) XP2.6
NetC1_2: C1.2 C4.2 DA1.1(IN) DA1.3(EN) L1.2
NetC9_2: C9.2 C10.2 C11.2 DA2.13(EN) DA2.15(IN) DA2.16(IN) L35.2
NetC12_2: C12.2 DD1.1(VL) DD1.3(DE) DD1.14(VCC) L3.2 R9.2
NetC13_2: C13.2 D1.53(PC12) R10.2
NetC14_2: C14.2 D1.13(VDDA) L4.1
NetC156_2: C156.2 DA2.14(NR)
NetC165_2: C165.2 DD2.9(VCC) L36.2
NetC166_2: C166.2 DD2.10(FB) VT10.D XP6.1
NetD1_7: D1.7(NRST) R13.1 XP2.5
NetD1_60: D1.60(BOOT0) R14.1
NetDD2_1: DD2.1(TACH0) R36.1 XP6.3
NetDD2_8: DD2.8(OUT) VT10.G
NetL2_1: L2.1 XP5.1
NetR8_2: R8.2 XP2.1

Not connected (* = marked no-connect by the designer): C9 1; C10 1; D1 2(PC13-TAMPER-RTC) 3(PC14-OSC32_IN) 4(PC15-OSC32_OUT) 5(PD0-OSC_IN) 6(PD1_OSC_OUT) 8(PC0) 9(PC1) 10(PC2) 11(PC3) 17(PA3) 27(PB1) 30(PB11) 33(PB12) 34(PB13) 35(PB14) 36(PB15) 37(PC6) 38(PC7) 39(PC8) 40(PC9) 41(PA8) 42(PA9) 43(PA10) 44(PA11) 45(PA12) 54(PD2) 56(PB4) 57(PB5) 61(PB8) 62(PB9); DA2 4(6P4V2) 5(6P4V1) 8(1P6V) 9(0P8V) 11(0P2V) 12(0P1V); DD2 6(GPIO1) 7(GPIO0)

### Notes on the sheet
- (near XP2) VREF
- (near XP2) SWCLK
- (near XP2) GND
- (near XP2) SWDIO
- (near XP2) NRST
- (near XP2) SWO
- (near DD2) Slave addr. 0x90
- Labels drawn without touching a wire or pin: GND
- Перв. примен.
- Справ. №
- Подп. и дата
- Инв. № дубл.
- Взам. инв. №
- Изм
- Лист
- № докум
- Подп.
- Дата
- Лит.
- Масса
- Масштаб
- Т. контр.
- Разраб.
- Пров.
- Листов
- Н. контр.
- Инв. № подп.
- Утв.
- Копировал
- Формат А3
- (in symbol Микросхема LP5907MFX-3.3) *STU
- (in symbol Микросхема STM32F103RCT6) MPU
- (in symbol Микросхема TPS7A4700RGW) *STU
- (in symbol Соединитель 22232031) Конт.; Цепь
- (in symbol Соединитель FH12-10S-0.5SVA) Конт.; Цепь
- (in symbol Соединитель PLS-6) Конт.; Цепь
- (in symbol Фильтр EMI EClamp2394P) Z*

### Library data of the parts
C1-C3 C20 = Кер.ЧИП конд. 0805 22мкФ X5R 10% 16В: Кер. ЧИП-конденсатор; Manufacturer: TDK; ManufacturerPartNumber: C2012X5R1C226KT; Power/Voltage: 16В; TKE: X5R; Tolerance: ±10%; Value: 22мк
C4 C12 C156 = Кер.ЧИП конд. 0402 1мкФ X5R 10%, 10В: Кер. ЧИП-конденсатор; Power/Voltage: 10В; TKE: X5R; Tolerance: ±10%; PackageReference: 0402; Value: 1мк
C6 = Конденсатор танталовый SMD D case 22мкФ ±20% 35B: Тант. ЧИП-конденсатор; Tolerance: ±20%; Published: 8-Jun-2000; LatestRevisionDate: 29-May-2009; LatestRevisionNote: IPC-7351 Footprint Added.; Publisher: Altium Limited; PackageDescription: Chip Capacitor; PackageReference: тип D; Value: 22мк
C7 C166 = Кер.ЧИП конд. 1210 10мкФ X5R 20% 50В: Кер. ЧИП-конденсатор; Manufacturer: Murata; ManufacturerPartNumber: GRM32ER71H106; Power/Voltage: 50В; TKE: X5R; Tolerance: ±20%; Value: 10мк
C8 C13 = Кер.ЧИП конд. 0402 0.01мкФ X7R 10%, 50В: as C25 on sheet PA_AMP_v1; Value: 0.01мк
C9 = CC1206KKX7R8BB106: ЧИП конденсатор; Manufacturer: Yageo; Tolerance: 10%; Value: 1206 10 мкФ 25В X7R; Type: X7R; RuNominal: 10 мкФ; Voltage: 25В; ManufacturerPartNumber: CC1206KKX7R8BB106; ID: 1206 10 мкФ 25В X7R; Rem: *
C10 = CC0805KKX5R8BB106: ЧИП конденсатор; Manufacturer: Yageo; Tolerance: 0,1; Value: 0805 10 мкФ 25В X7R; Type: X7R; RuNominal: 10 мкФ; Voltage: 25В; ManufacturerPartNumber: CC0805KKX5R8BB106; ID: 0805 10 мкФ 25В X7R; Rem: *
C11 C14-C19 C165 = Кер.ЧИП конд. 0402 0.1мкФ X7R 10%, 16В: as C26 on sheet PA_AMP_v1; PackageReference: 0402; Value: 0.1мк
C155 = Кер.ЧИП конд. 0805 47мкФ X5R 20% 10В: Кер. ЧИП-конденсатор; Manufacturer: Murata; ManufacturerPartNumber: GRM21BR61A476ME15L; Power/Voltage: 10В; TKE: X5R; Tolerance: ±20%; Value: 47мк
D1 = Микросхема STM32F103RCT6: Ultra-low-power 32-bit MCU ARM®-based Cortex®-M3, 128KB Flash, 16KB SRAM, 4KB EEPROM, LCD, USB, ADC, DAC; Manufacturer: STMicroelectronics; Published: 29-Jan-2009; Code_JEDEC: MS-026; ComponentLink1Description: Manufacturer Link; ComponentLink3Description: Packaging Specification; Value: STM32F103RCT6
DA1 = Микросхема LP5907MFX-3.3: 250-mA Ultra-Low-Noise, Low-IQ LDO; Manufacturer: TI; Value: LP5907MFX-3.3; ComponentLink1Description: datasheet; ComponentLink1URL: http://www.ti.com/lit/ds/symlink/lp5907.pdf
DA2 = Микросхема TPS7A4700RGW: 36-V, 1-A, 4-µVRMS, RF LDO Voltage Regulator; Manufacturer: TI; Value: TPS7A4700; ComponentLink1Description: datasheet; ComponentLink1URL: http://www.ti.com/lit/ds/symlink/tps7a47.pdf
DD1 = Микросхема MAX13433EETD+: RS-422 Transceivers with Low-Voltage Logic Interface 16M; Manufacturer: Maxim; Value: MAX13433EETD+; ComponentLink1Description: datasheet; ComponentLink1URL: https://datasheets.maximintegrated.com/en/ds/MAX13430E-MAX13433E.pdf
DD2 = Микросхема MAX6650EUB: Fan-Speed Regulators and Monitors with SMBus/I2C-Compatible Interface; Manufacturer: Maxim; Value: MAX6650EUB; ComponentLink1Description: datasheet; ComponentLink1URL: https://www.analog.com/media/en/technical-documentation/data-sheets/MAX6650-MAX6651.pdf
L1 L2 L35 = ЧИП индуктивность CSAB0420-2R2M: as L8 on sheet PA_AMP_v1; Value: 2,2мкГн
L3 L4 L36 = ЧИП дроссель 0603 BLM18PG121SN1D: as L7 on sheet PA_AMP_v1; ManufacturerPartNumber: BLM18PG121SN1D; Value: BLM18PG121SN1D
R4 R8 R10 R14 = Чип резистор 0402 100 Ом, 5%: as R18 on sheet PA_AMP_v1; PackageReference: 0402; Value: 100
R5 R11 R13 R36 = Чип резистор 0402 10 кОм, 5%: as R25 on sheet PA_AMP_v1; PackageReference: 0402; Value: 10к
R6 R7 = Чип резистор 0402 4,7 кОм, 5%: ЧИП-резистор; Tolerance: ±5%; TKE: 100 ppm/°С; PackageReference: 0402; Value: 4.7к
R9 R12 = Чип резистор 0402 180 кОм, 5%: ЧИП-резистор; Tolerance: ±5%; TKE: 100 ppm/°С; PackageReference: 0402; Value: 180к
VT10 = ЧИП транзистор SiSS10DN: N-Channel 40 V (D-S) MOSFET; ComponentLink1Description: datasheet; ComponentLink1URL: https://www.vishay.com/docs/65439/siss10dn.pdf; Value: SiSS10DN
XP1 = Соединитель XT60-F: AMASS XT60-F; Value: XT60-F
XP2 = Соединитель PLS-6: Вилка штыревая 2.54мм 1x6 прямая тип1; LatestRevisionDate: 17-Jul-2002; LatestRevisionNote: Re-released for DXP Platform.; Publisher: Altium Limited; Value: PLS-6
XP3 XP4 = Соединитель FH12-10S-0.5SVA: 0.5mm  Pitch FPC/FFC Connector FH12 Series; Manufacturer: Hirose; Value: FH12-10S-0.5SVA
XP5 = Соединитель XT30UPB-M: AMASS XT30UPB-M  5 mm; Value: XT30UPB-M
XP6 = Соединитель 22232031: Molex 2,54 мм pitch-3; Manufacturer: Connfly; Value: 22232031
Z1 = Фильтр EMI EClamp2394P: ESD/EMI Protection  for Color LCD Interfaces; Manufacturer: SEMTECH; PackageReference: SLP2116P8; Value: EClamp2394P

## Nets that join several sheets
ADC_CURRENT: PA_AMP_v1 (C26.2 R18.1), PA_MCU (D1.16)
ADC_TEMP: PA_AMP_v1 (DA5.3 DA5.4), PA_MCU (D1.15)
ADC_VOLT: PA_AMP_v1 (DA4.3 DA4.4), PA_MCU (D1.14)
BAND0_EN: PA_LPF (VT7.1), PA_MCU (D1.29)
BAND1_EN: PA_LPF (VT5.1), PA_MCU (D1.28)
BAND2_EN: PA_LPF (VT3.1), PA_MCU (D1.26)
BAND3_EN: PA_LPF (VT8.1), PA_MCU (D1.25)
BAND4_EN: PA_LPF (VT6.1), PA_MCU (D1.24)
BAND5_EN: PA_LPF (VT4.1), PA_MCU (D1.23)
BAND6_EN: PA_LPF (VT9.1), PA_MCU (D1.22)
DAC_BIAS1: PA_AMP_v1 (R24.1), PA_MCU (D1.20)
DAC_BIAS2: PA_AMP_v1 (R32.1), PA_MCU (D1.21)
GND: PA_AMP_v1 (40 pins), PA_LPF (94 pins), PA_MCU (52 pins)
PA_OUT: PA_AMP_v1 (T1.4), PA_LPF (7 pins)
VDD_3V3: PA_AMP_v1 (L7.1 L9.1 L10.1), PA_MCU (21 pins)
VDD_5V0: PA_AMP_v1 (L32.1 L33.1), PA_MCU (C155.2 DA2.1 DA2.3 DA2.20)
VDD_12V: PA_LPF (29 pins), PA_MCU (6 pins)
VDD_28V: PA_AMP_v1 (L5.1), PA_MCU (XP1.1)